# Altium project NA61_BPD_FEE.PrjPcb (part 4 of 4)
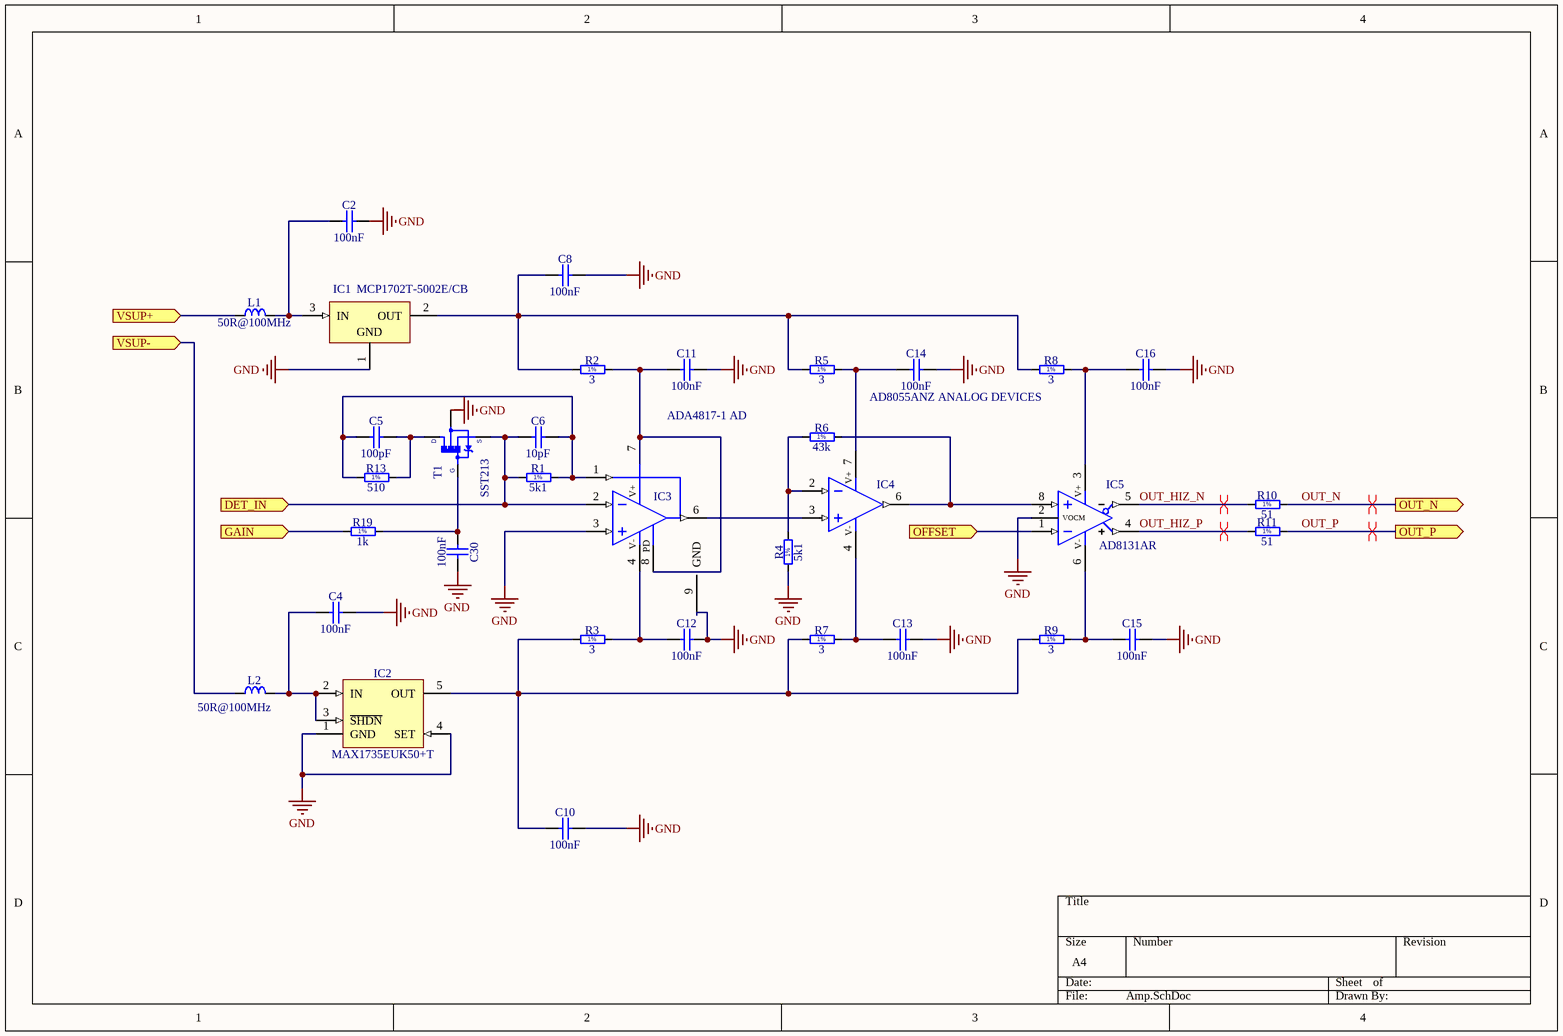
[diagram p4: Amp.SchDoc]

## Nets that join several sheets (continued)
OUT_E_P_U_Bank1: U_Bank1 (J1_U_Bank1.13), U_Bank1/U_Amp (R11_U_Amp1.2)
OUT_E_P_U_Bank2: U_Bank2 (J1_U_Bank2.13), U_Bank2/U_Amp (R11_U_Bank2_U_Amp#5.2)
OUT_E_P_U_Bank3: U_Bank3 (J1_U_Bank3.13), U_Bank3/U_Amp (R11_U_Bank3_U_Amp#5.2)
OUT_E_P_U_Bank4: U_Bank4 (J1_U_Bank4.13), U_Bank4/U_Amp (R11_U_Bank4_U_Amp#5.2)
OUT_E_P_U_Bank5: U_Bank5 (J1_U_Bank5.13), U_Bank5/U_Amp (R11_U_Bank5_U_Amp#5.2)
OUT_E_P_U_Bank6: U_Bank6 (J1_U_Bank6.13), U_Bank6/U_Amp (R11_U_Bank6_U_Amp#5.2)
OUT_E_P_U_Bank7: U_Bank7 (J1_U_Bank7.13), U_Bank7/U_Amp (R11_U_Bank7_U_Amp#5.2)
OUT_E_P_U_Bank8: U_Bank8 (J1_U_Bank8.13), U_Bank8/U_Amp (R11_U_Bank8_U_Amp#5.2)
OUT_E_P_U_Bank9: U_Bank9 (J1_U_Bank9.13), U_Bank9/U_Amp (R11_U_Bank9_U_Amp#5.2)
OUT_E_P_U_Bank10: U_Bank10 (J1_U_Bank10.13), U_Bank10/U_Amp (R11_U_Bank10_U_Amp#5.2)
OUT_E_P_U_Bank11: U_Bank11 (J1_U_Bank11.13), U_Bank11/U_Amp (R11_U_Bank11_U_Amp#5.2)
OUT_E_P_U_Bank12: U_Bank12 (J1_U_Bank12.13), U_Bank12/U_Amp (R11_U_Bank12_U_Amp#5.2)
OUT_E_P_U_Bank13: U_Bank13 (J1_U_Bank13.13), U_Bank13/U_Amp (R11_U_Bank13_U_Amp#5.2)
OUT_E_P_U_Bank14: U_Bank14 (J1_U_Bank14.13), U_Bank14/U_Amp (R11_U_Bank14_U_Amp#5.2)
OUT_E_P_U_Bank15: U_Bank15 (J1_U_Bank15.13), U_Bank15/U_Amp (R11_U_Bank15_U_Amp#5.2)
OUT_E_P_U_Bank16: U_Bank16 (J1_U_Bank16.13), U_Bank16/U_Amp (R11_U_Bank16_U_Amp#5.2)
OUT_E_P_U_Bank17: U_Bank17 (J1_U_Bank17.13), U_Bank17/U_Amp (R11_U_Bank17_U_Amp#5.2)
OUT_E_P_U_Bank18: U_Bank18 (J1_U_Bank18.13), U_Bank18/U_Amp (R11_U_Bank18_U_Amp#5.2)
OUT_E_P_U_Bank19: U_Bank19 (J1_U_Bank19.13), U_Bank19/U_Amp (R11_U_Bank19_U_Amp#5.2)
OUT_E_P_U_Bank20: U_Bank20 (J1_U_Bank20.13), U_Bank20/U_Amp (R11_U_Bank20_U_Amp#5.2)